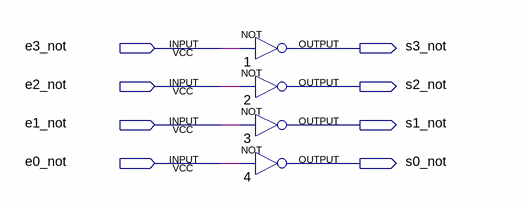
[diagram p0: schematic sheet]
// Quartus schematic notOp.bdf as structural Verilog: 4 symbols, 8 pins
module notOp (
  input  e3_not,
  input  e2_not,
  input  e1_not,
  input  e0_not,
  output s3_not,
  output s2_not,
  output s1_not,
  output s0_not
);

  not u_1 (s3_not, e3_not);
  not u_2 (s2_not, e2_not);
  not u_3 (s1_not, e1_not);
  not u_4 (s0_not, e0_not);
endmodule
